# Altium schematic sheet Mechanical.SchDoc: Carte Découpe DMX
size A4
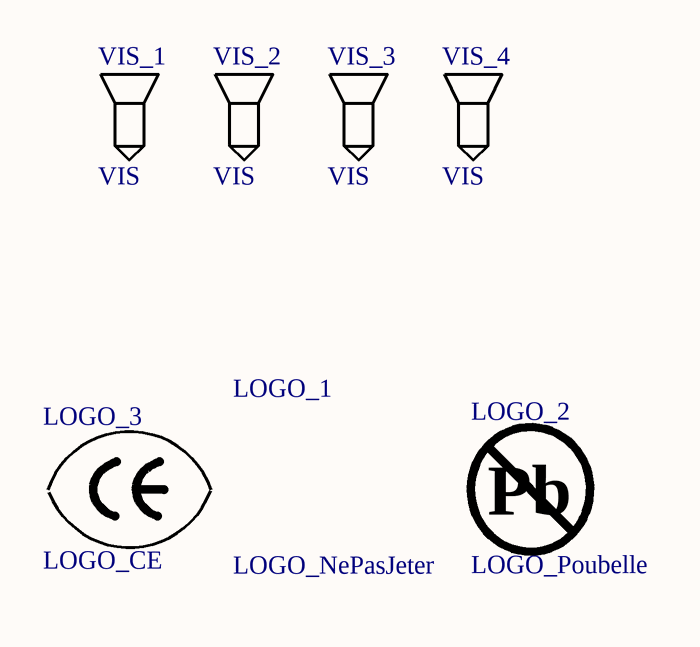
[diagram p0: Mechanical.SchDoc]

## Parts
LOGO_1  LOGO_NePasJeter  [LogoNePasJeter]
LOGO_2  LOGO_Poubelle  [LogoPB]
LOGO_3  LOGO_CE  [LogoCE]
VIS_1  VIS  [HOLE3.5mm]
VIS_2  VIS  [HOLE3.5mm]
VIS_3  VIS  [HOLE3.5mm]
VIS_4  VIS  [HOLE3.5mm]

## Notes on the sheet
- Title
- Size:
- Date:
- A4
- Number:
- Time:
- Revision:
- Sheet
- of
- File:
- (in symbol LOGO_Poubelle) Pb

## Library data of the parts
LOGO_1 = LOGO_NePasJeter: Logo Ne Pas Jeter (sérigraphie)
LOGO_2 = LOGO_Poubelle: Logo poubelle (sérigraphie)
LOGO_3 = LOGO_CE: Logo CE (sérigraphie)